# EAGLE design RPiEvm (EAGLE 9.6.2)
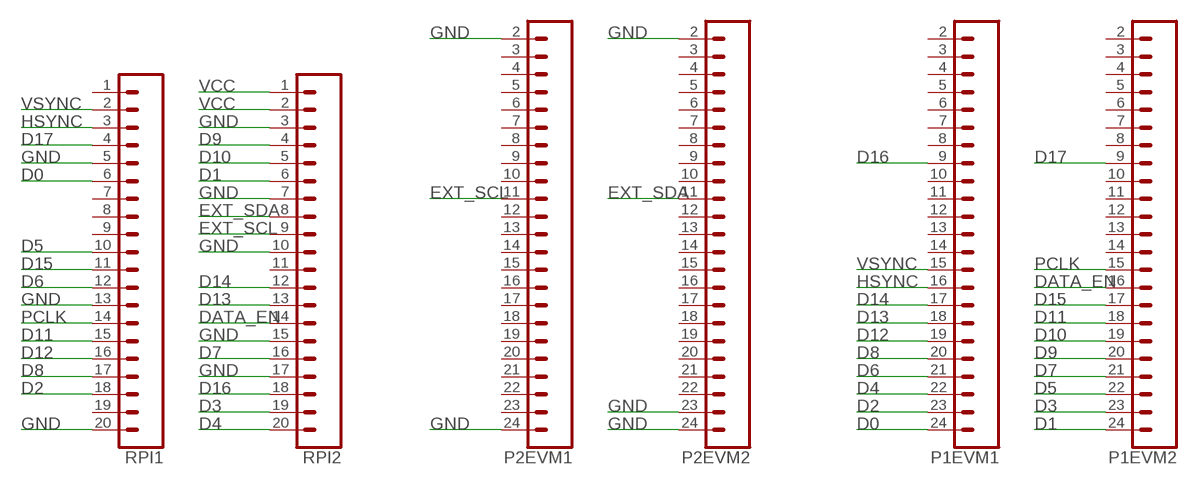
[diagram p0: schematic, sheet 1]

## Parts
P1EVM1  CONN_23  [1X23]
P1EVM2  CONN_23  [1X23]
P2EVM1  CONN_23  [1X23]
P2EVM2  CONN_23  [1X23]
RPI1  CONN_20  [1X20]
RPI2  CONN_20  [1X20]

## Nets
D0: P1EVM1.24 RPI1.6
D1: P1EVM2.24 RPI2.6
D2: P1EVM1.23 RPI1.18
D3: P1EVM2.23 RPI2.19
D4: P1EVM1.22 RPI2.20
D5: P1EVM2.22 RPI1.10
D6: P1EVM1.21 RPI1.12
D7: P1EVM2.21 RPI2.16
D8: P1EVM1.20 RPI1.17
D9: P1EVM2.20 RPI2.4
D10: P1EVM2.19 RPI2.5
D11: P1EVM2.18 RPI1.15
D12: P1EVM1.19 RPI1.16
D13: P1EVM1.18 RPI2.13
D14: P1EVM1.17 RPI2.12
D15: P1EVM2.17 RPI1.11
D16: P1EVM1.9 RPI2.18
D17: P1EVM2.9 RPI1.4
DATA_EN: P1EVM2.16 RPI2.14
EXT_SCL: P2EVM1.11 RPI2.9
EXT_SDA: P2EVM2.11 RPI2.8
GND: P2EVM1.2 P2EVM1.24 P2EVM2.2 P2EVM2.23 P2EVM2.24 RPI1.5 RPI1.13 RPI1.20 RPI2.3 RPI2.7 RPI2.10 RPI2.15 RPI2.17
HSYNC: P1EVM1.16 RPI1.3
PCLK: P1EVM2.15 RPI1.14
VCC: RPI2.1 RPI2.2
VSYNC: P1EVM1.15 RPI1.2
Unconnected: P1EVM1.2 P1EVM1.3 P1EVM1.4 P1EVM1.5 P1EVM1.6 P1EVM1.7 P1EVM1.8 P1EVM1.10 P1EVM1.11 P1EVM1.12 P1EVM1.13 P1EVM1.14 P1EVM2.2 P1EVM2.3 P1EVM2.4 P1EVM2.5 P1EVM2.6 P1EVM2.7 P1EVM2.8 P1EVM2.10 P1EVM2.11 P1EVM2.12 P1EVM2.13 P1EVM2.14 P2EVM1.3 P2EVM1.4 P2EVM1.5 P2EVM1.6 P2EVM1.7 P2EVM1.8 P2EVM1.9 P2EVM1.10 P2EVM1.12 P2EVM1.13 P2EVM1.14 P2EVM1.15 P2EVM1.16 P2EVM1.17 P2EVM1.18 P2EVM1.19 P2EVM1.20 P2EVM1.21 P2EVM1.22 P2EVM1.23 P2EVM2.3 P2EVM2.4 P2EVM2.5 P2EVM2.6 P2EVM2.7 P2EVM2.8 P2EVM2.9 P2EVM2.10 P2EVM2.12 P2EVM2.13 P2EVM2.14 P2EVM2.15 P2EVM2.16 P2EVM2.17 P2EVM2.18 P2EVM2.19 P2EVM2.20 P2EVM2.21 P2EVM2.22 RPI1.1 RPI1.7 RPI1.8 RPI1.9 RPI1.19 RPI2.11

## Library data of the parts
P1EVM1 P1EVM2 P2EVM1 P2EVM2 = SparkFun-Connectors:CONN_23: Multi connection point. Often used as Generic Header-pin footprint for 0.1 inch spaced/style header connections On any of the 0.1 inch spaced packages, you can populate with these: Break Away Headers - Straight <https://www.sparkfun.com/products/116> (PRT-00116) Break Away Male Headers - Right Angle <https://www.sparkfun.com/products/553> (PRT-00553) Female Headers <https://www.sparkfun.com/products/115> (PRT-00115) Break Away Headers - Machine Pin <https://www.sparkfun.com/products/117> (PRT-00117) Break Away Female Headers - Swiss Machine Pin <https://www.sparkfun.com/products/743> (PRT-00743) For SCREWTERMINALS and SPRING TERMINALS visit here: Screw Terimnals on SparkFun.com <https://www.sparkfun.com/search/results?term=Screw+Terminals> (5mm/3.5mm/2.54mm spacing) This device is also useful as a general connection point to wire up your design to another part of your project. Our various solder wires solder well into these plated through hole pads. Hook-Up Wire - Assortment (Stranded, 22 AWG) <https://www.sparkfun.com/products/11375> (PRT-11375) Hook-Up Wire - Assortment (Solid Core, 22 AWG) <https://www.sparkfun.com/products/11367> (PRT-11367) View the entire wire category on our website here <https://www.sparkfun.com/categories/141> Special notes: Molex polarized connector foot print use with SKU : PRT-08231 with associated crimp pins and housings. 1MM SMD Version SKU: PRT-10208 NOTES ON THE VARIANTS LOCK and LOCK_LONGPADS... This footprint was designed to help hold the alignment of a through-hole component (i.e. 6-pin header) while soldering it into place. You may notice that each hole has been shifted either up or down by 0.005 of an inch from it's more standard position (which is a perfectly straight line). This slight alteration caused the pins (the squares in the middle) to touch the edges of the holes. Because they are alternating, it causes a "brace" to hold the component in place. 0.005 has proven to be the perfect amount of "off-center" position when using our standard breakaway headers. Although looks a little odd when you look at the bare footprint, once you have a header in there, the alteration is very hard to notice. Also,if you push a header all the way into place, it is covered up entirely on the bottom side.
RPI1 RPI2 = SparkFun-Connectors:CONN_20: Multi connection point. Often used as Generic Header-pin footprint for 0.1 inch spaced/style header connections On any of the 0.1 inch spaced packages, you can populate with these: Break Away Headers - Straight <https://www.sparkfun.com/products/116> (PRT-00116) Break Away Male Headers - Right Angle <https://www.sparkfun.com/products/553> (PRT-00553) Female Headers <https://www.sparkfun.com/products/115> (PRT-00115) Break Away Headers - Machine Pin <https://www.sparkfun.com/products/117> (PRT-00117) Break Away Female Headers - Swiss Machine Pin <https://www.sparkfun.com/products/743> (PRT-00743) For SCREWTERMINALS and SPRING TERMINALS visit here: Screw Terimnals on SparkFun.com <https://www.sparkfun.com/search/results?term=Screw+Terminals> (5mm/3.5mm/2.54mm spacing) This device is also useful as a general connection point to wire up your design to another part of your project. Our various solder wires solder well into these plated through hole pads. Hook-Up Wire - Assortment (Stranded, 22 AWG) <https://www.sparkfun.com/products/11375> (PRT-11375) Hook-Up Wire - Assortment (Solid Core, 22 AWG) <https://www.sparkfun.com/products/11367> (PRT-11367) View the entire wire category on our website here <https://www.sparkfun.com/categories/141> Special notes: Molex polarized connector foot print use with SKU : PRT-08231 with associated crimp pins and housings. 1MM SMD Version SKU: PRT-10208 NOTES ON THE VARIANTS LOCK and LOCK_LONGPADS... This footprint was designed to help hold the alignment of a through-hole component (i.e. 6-pin header) while soldering it into place. You may notice that each hole has been shifted either up or down by 0.005 of an inch from it's more standard position (which is a perfectly straight line). This slight alteration caused the pins (the squares in the middle) to touch the edges of the holes. Because they are alternating, it causes a "brace" to hold the component in place. 0.005 has proven to be the perfect amount of "off-center" position when using our standard breakaway headers. Although looks a little odd when you look at the bare footprint, once you have a header in there, the alteration is very hard to notice. Also,if you push a header all the way into place, it is covered up entirely on the bottom side. Note about LOCK SPECIAL package: This is just like the LOCK variant in that the holes are staggared by 5 mil, but except for the last two holes. They are not altered from the "standard" footprint layout. This is used for a special purpose on the layout of our Graphic LCD Backpack. Make sure you want to use this device before selecting it for you project!

## Board
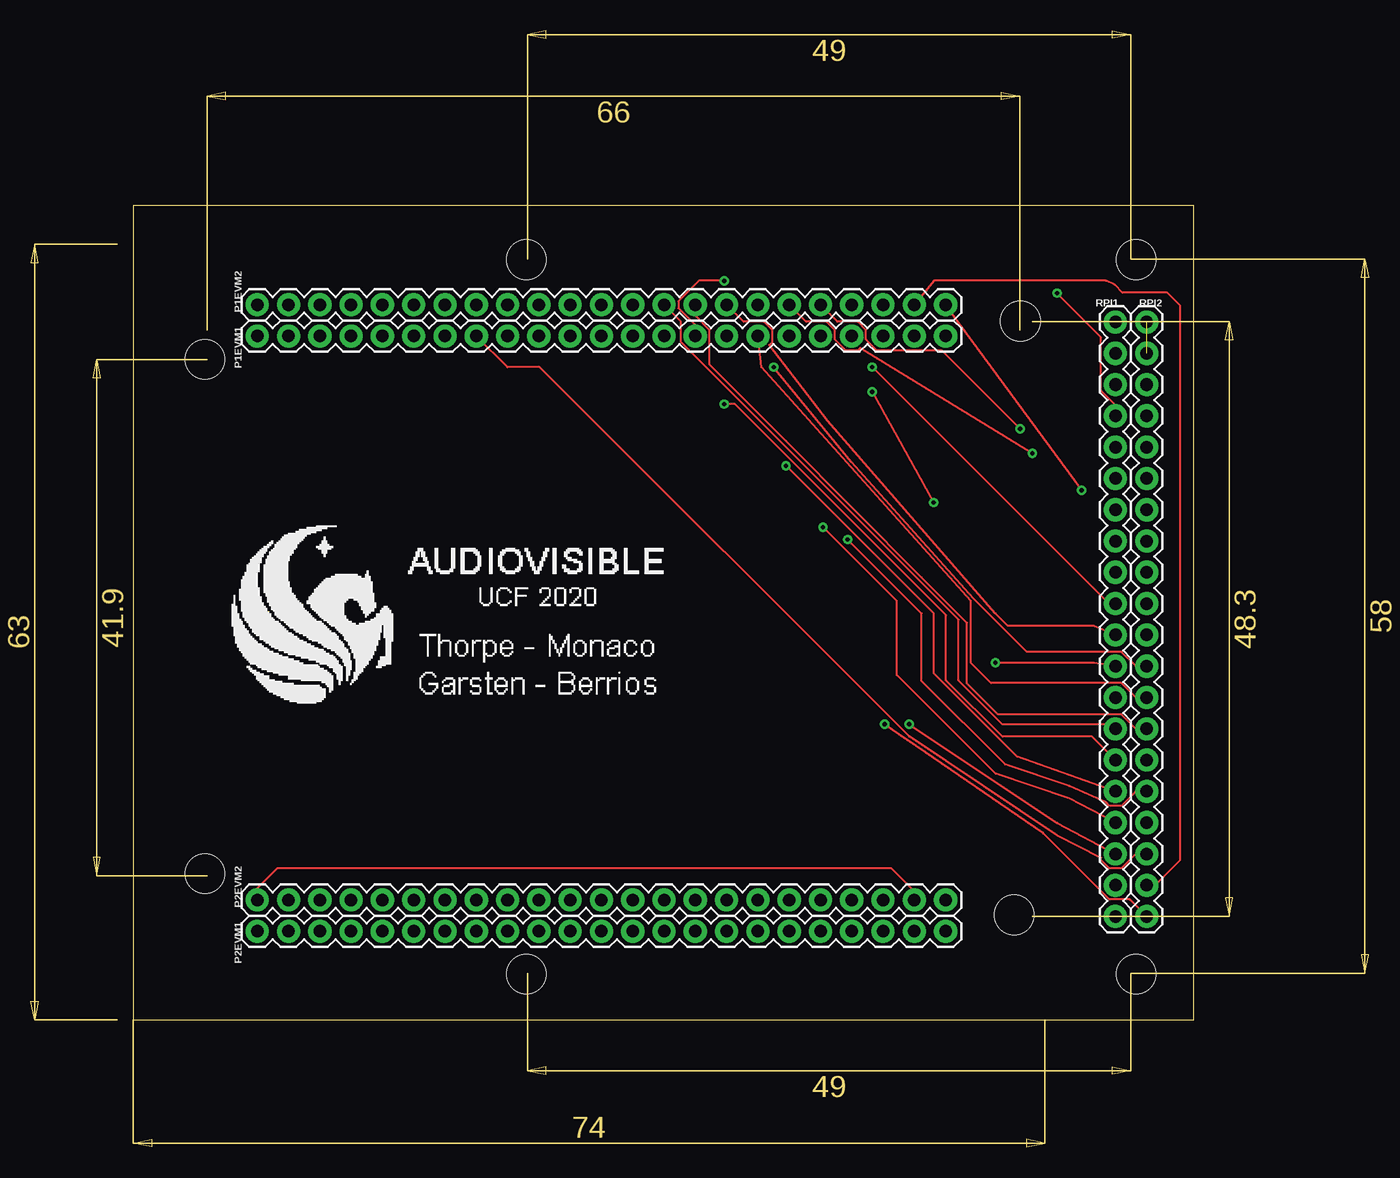
[diagram p1: board, top side]
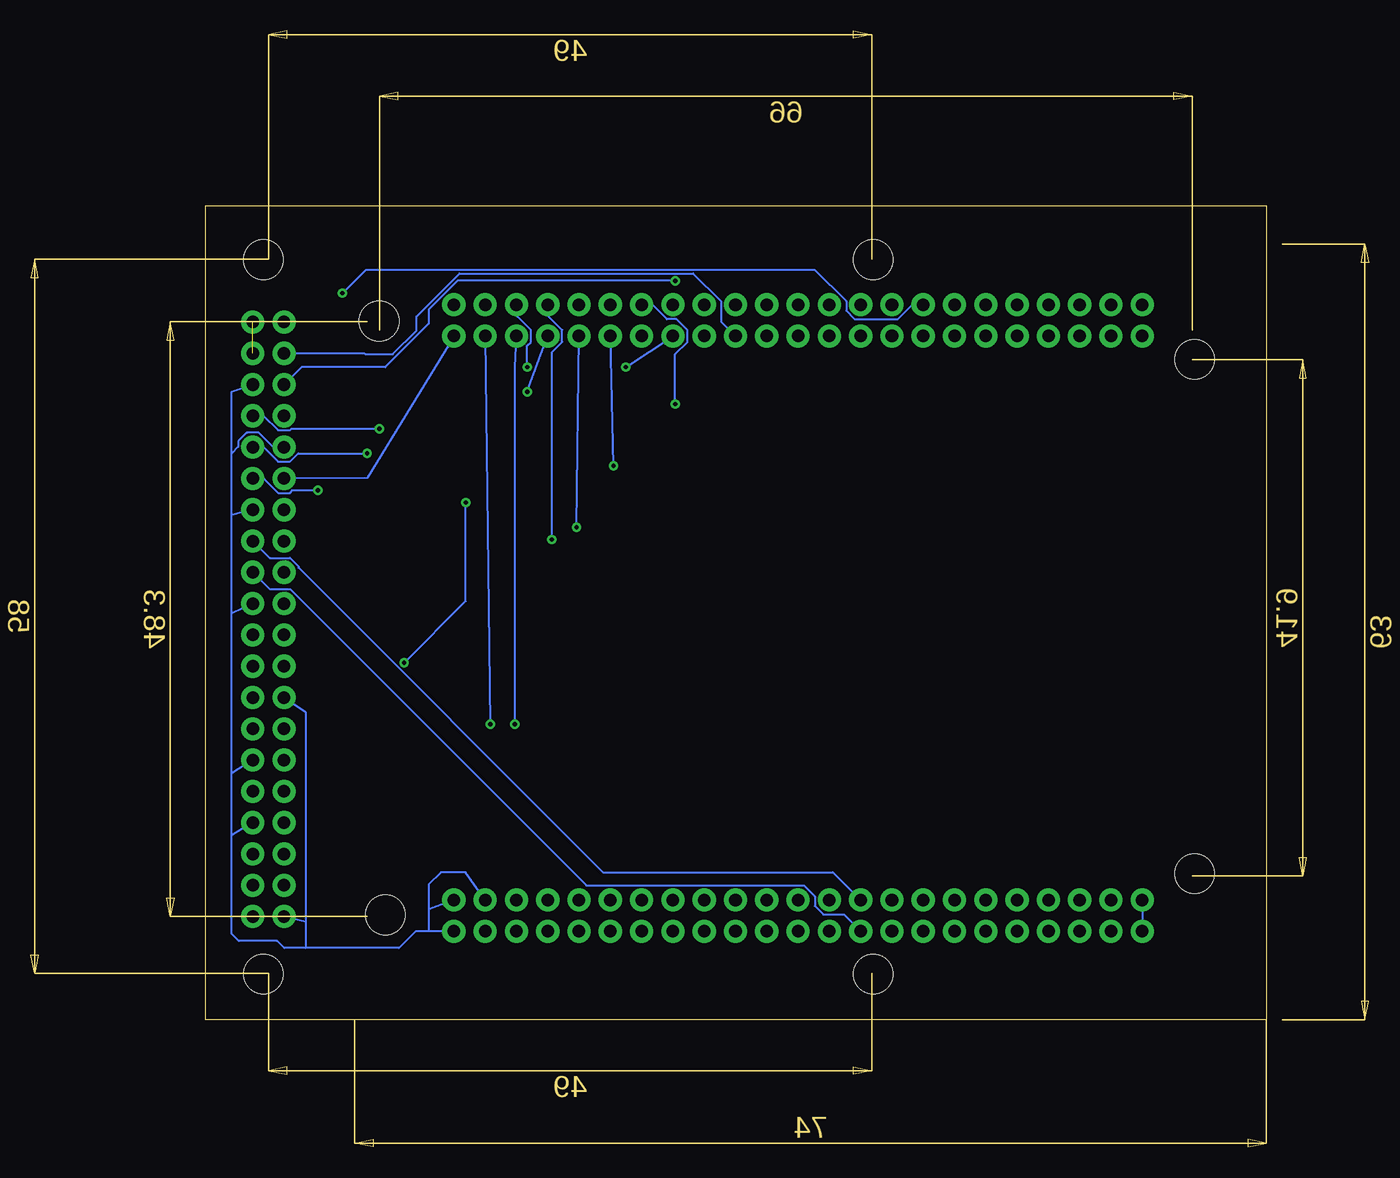
[diagram p2: board, bottom side, seen from below]

Size 86.09 x 66.09 mm. Coordinates in mm from the lower left corner, seen from the top.
Outline: 0,0 86.09,0 86.09,66.09 0,66.09 0,0
Copper layers (1*16): Top 0.035mm / dielectric 1.5mm / Bottom 0.035mm
Design rules "default": minimum track width 6mil, minimum drill 0.35mm, track to track 6mil, track to pad 6mil, pad to pad 6mil, via to via 6mil, smd to smd 6mil, copper to edge 40mil, drill to drill 6mil, minimum pad ring 10mil, minimum via ring 8mil, stop-mask expansion 4mil, vias tented up to drill 0mil, thermal gap 10mil

### Footprints (pad centres in the part's own frame; a part is rotated, then mirrored left to right if it is on the bottom)
1X23 = drill 1.016 pad 1.88: 2 -26.67,0; 3 -24.13,0; 4 -21.59,0; 5 -19.05,0; 6 -16.51,0; 7 -13.97,0; 8 -11.43,0; 9 -8.89,0; 10 -6.35,0; 11 -3.81,0; 12 -1.27,0; 13 1.27,0; 14 3.81,0; 15 6.35,0; 16 8.89,0; 17 11.43,0; 18 13.97,0; 19 16.51,0; 20 19.05,0; 21 21.59,0; 22 24.13,0; 23 26.67,0; 24 29.21,0
1X20 = drill 1.016 pad 1.88: 1 0,0; 2 2.54,0; 3 5.08,0; 4 7.62,0; 5 10.16,0; 6 12.7,0; 7 15.24,0; 8 17.78,0; 9 20.32,0; 10 22.86,0; 11 25.4,0; 12 27.94,0; 13 30.48,0; 14 33.02,0; 15 35.56,0; 16 38.1,0; 17 40.64,0; 18 43.18,0; 19 45.72,0; 20 48.26,0
3_2_HOLE = hole 3.2: -1.57,1.73

### Placement (x,y rotation side)
P1EVM1  36.75,55.52 0 top
P1EVM2  36.75,58.06 0 top
P2EVM1  36.75,7.2 0 top
P2EVM2  36.75,9.74 0 top
RPI1  79.74,56.66 270 top
RPI2  82.28,56.66 270 top
U$1  [3_2_HOLE]  83,2 0 top
U$2  [3_2_HOLE]  83,60 0 top
U$3  [3_2_HOLE]  73.6,55 0 top
U$4  [3_2_HOLE]  73.1,6.8 0 top
U$5  [3_2_HOLE]  7.4,51.9 0 top
U$6  [3_2_HOLE]  7.4,10.15 0 top
U$7  [3_2_HOLE]  33.5,60 0 top
U$8  [3_2_HOLE]  33.5,2 0 top

### Tracks (layer width: path | path; a pad name or v marks a point on that pad's centre or on a via)
D0
  Bottom 0.152: P1EVM1.24 73,44 RPI1.6
D1  (via drill 0.35)
  Top 0.152: v77,43 P1EVM2.24
  Bottom 0.152: RPI2.6 81.39,43.96 80.22,42.79 79.26,42.79 79.05,43 v77,43
D2  (via drill 0.35)
  Top 0.152: v63,24 75,16 RPI1.18
  Bottom 0.152: P1EVM1.23 v63,24
D3
  Top 0.152: RPI2.19 82.94,10.94 85,13 85,58 83.96,59.04 80.31,59.04 79.68,59.68 79,60 65,60 P1EVM2.23
D4  (via drill 0.35)
  Top 0.152: RPI2.20 80.91,9.77 79.26,9.77 73.89,15.14 62.9,22.7 62.87,22.7 62.82,22.75 v61,24
  Bottom 0.152: P1EVM1.22 61,53 v61,24
D5  (via drill 0.35)
  Top 0.152: RPI1.10 79.54,34 79,34 v60,53
  Bottom 0.152: v60,53 60,54.75 59.71,55.04 59.71,56 60.88,57.17 P1EVM2.22
D6  (via drill 0.35)
  Top 0.152: RPI1.12 78,29 v70,29 | v65,42 v60,51
  Bottom 0.152: v60,51 P1EVM1.21 | v70,29 65,34 v65,42
D7  (via drill 0.35)
  Top 0.152: RPI2.16 81.39,18.56 80.22,17.39 79.26,17.39 79,17.65 76,19 70.8,20.73 64,27.53 64,33 v58,39
  Bottom 0.152: v58,39 58,54.21 57.17,55.04 57.17,56 58.34,57.17 P1EVM2.21
D8  (via drill 0.35)
  Top 0.152: RPI1.17 76,18 70,20 62,28 62,34 v56,40
  Bottom 0.152: v56,40 P1EVM1.20
D9  (via drill 0.35)
  Top 0.152: v72,48 65.65,54.35 60.4,54.35 59.51,55.24 59.51,56 58.82,56.69 57.17,56.69 P1EVM2.20
  Bottom 0.152: RPI2.4 81.39,49.04 80.22,47.87 79.26,47.87 79.13,48 v72,48
D10  (via drill 0.35)
  Top 0.152: v73,46 59.02,54.54 58.82,54.35 57.86,54.35 56.97,55.24 56.97,56 56.28,56.69 54.63,56.69 P1EVM2.19
  Bottom 0.152: RPI2.5 81.39,46.5 80.22,45.33 79.26,45.33 78.59,46 v73,46
D11  (via drill 0.35)
  Top 0.152: RPI1.15 77.84,23 70.57,23 66,27.57 66,32.86 48.86,50 v48,50
  Bottom 0.152: P1EVM2.18 49.83,58.06 48.66,56.89 47.9,56.89 47.01,56 47,56 47.01,55.99 47.01,55.04 48,54.05 v48,50
D12  (via drill 0.35)
  Top 0.152: v53,45 65,33 65,28.14 71.76,21.38 RPI1.16
  Bottom 0.152: v53,45 P1EVM1.19
D13
  Top 0.152: RPI2.13 81.39,26.18 80.22,27.35 69.65,27.35 68,29 68,34 51,53 P1EVM1.18
D14  (via drill 0.35)
  Top 0.152: RPI2.12 81.39,28.72 80.22,29.89 72.54,29.89 68.22,34.21 58.32,45.28 v52,53
  Bottom 0.152: v52,53 P1EVM1.17
D15
  Top 0.152: RPI1.11 78,32 71,32 70,33 56.39,48.63 51.66,54.8 51.89,55.04 51.89,56 51.2,56.69 49.55,56.69 P1EVM2.17
D16
  Top 0.152: RPI2.18 81.39,13.48 80.22,12.31 79.26,12.31 78.57,13 78.57,13.16 75,15 63,23 33,53 30.38,53 P1EVM1.9
D17  (via drill 0.35)
  Top 0.152: RPI1.4 79.74,49.93 78.57,51.1 78.57,55.43 v75,59
  Bottom 0.152: P1EVM2.9 28.75,58.06 29.92,56.89 33.42,56.89 34.11,57.58 34.11,58.34 36.68,60.91 73.09,60.91 v75,59
DATA_EN
  Top 0.152: RPI2.14 81.39,23.64 80.22,24.81 70.19,24.81 67.69,27.3 67.69,32.24 64,35.94 53,47 46.81,53.19 46.81,56 45.64,57.17 P1EVM2.16
EXT_SCL
  Bottom 0.152: RPI2.9 80.91,34.97 79.26,34.97 55.2,10.91 37.54,10.91 36.65,10.02 36.65,9.26 35.96,8.57 34.31,8.57 P2EVM1.11
EXT_SDA
  Bottom 0.152: RPI2.8 80.91,37.51 79.26,37.51 78.57,36.82 78.57,36.71 53.86,12 35.2,12 P2EVM2.11
GND
  Top 0.152: P2EVM2.2 10.08,10.69 11.73,12.34 61.52,12.34 63.42,10.44 P2EVM2.23
  Bottom 0.152: P2EVM1.24 68,7.2 | 68,7.2 69.05,7.2 70.42,5.84 78,5.84 | 78,5.84 79.73,5.84 80.31,6.42 83.42,6.42 84,7 84,15 | 84,15 84,20 | 84,20 84,33 | 84,33 84,41 | 84,41 84,46 | 84,46 84,51 RPI2.3 | RPI2.7 84,41 | RPI2.10 84,33 | RPI2.15 84,20 | RPI2.17 84,15 | RPI1.13 78,25 78,8 | 78,8 78,5.84 | P2EVM2.23 65,12 67,12 68,11 68,9 | 68,9 68,7.2 | P2EVM2.24 68,9 | 84,46 83.45,46.55 83.45,46.98 82.76,47.67 81.8,47.67 80.63,46.5 RPI1.5 | RPI1.20 78,8 | P2EVM2.2 P2EVM1.2
HSYNC  (via drill 0.35)
  Top 0.152: P1EVM1.16 45.64,56.41 44.27,57.78 44.27,58.34 45.93,60 v48,60
  Bottom 0.152: RPI1.3 78.32,53 71.52,53 68,56.52 68,57.67 65.67,60 v48,60
PCLK
  Top 0.152: P1EVM2.15 44.47,56.69 44.47,55.04 67,32.51 67,27.57 70.57,24 79.38,24 RPI1.14
VCC  (1 unrouted)
VSYNC
  Bottom 0.152: RPI1.2 73.23,54.12 73.14,54.04 70.92,54.04 69,55.95 69,57.1 65.5,60.61 46.53,60.61 44.27,58.34 44.27,56.69 P1EVM1.15